# EAGLE design fp_binding_posts (EAGLE 9.3.1)
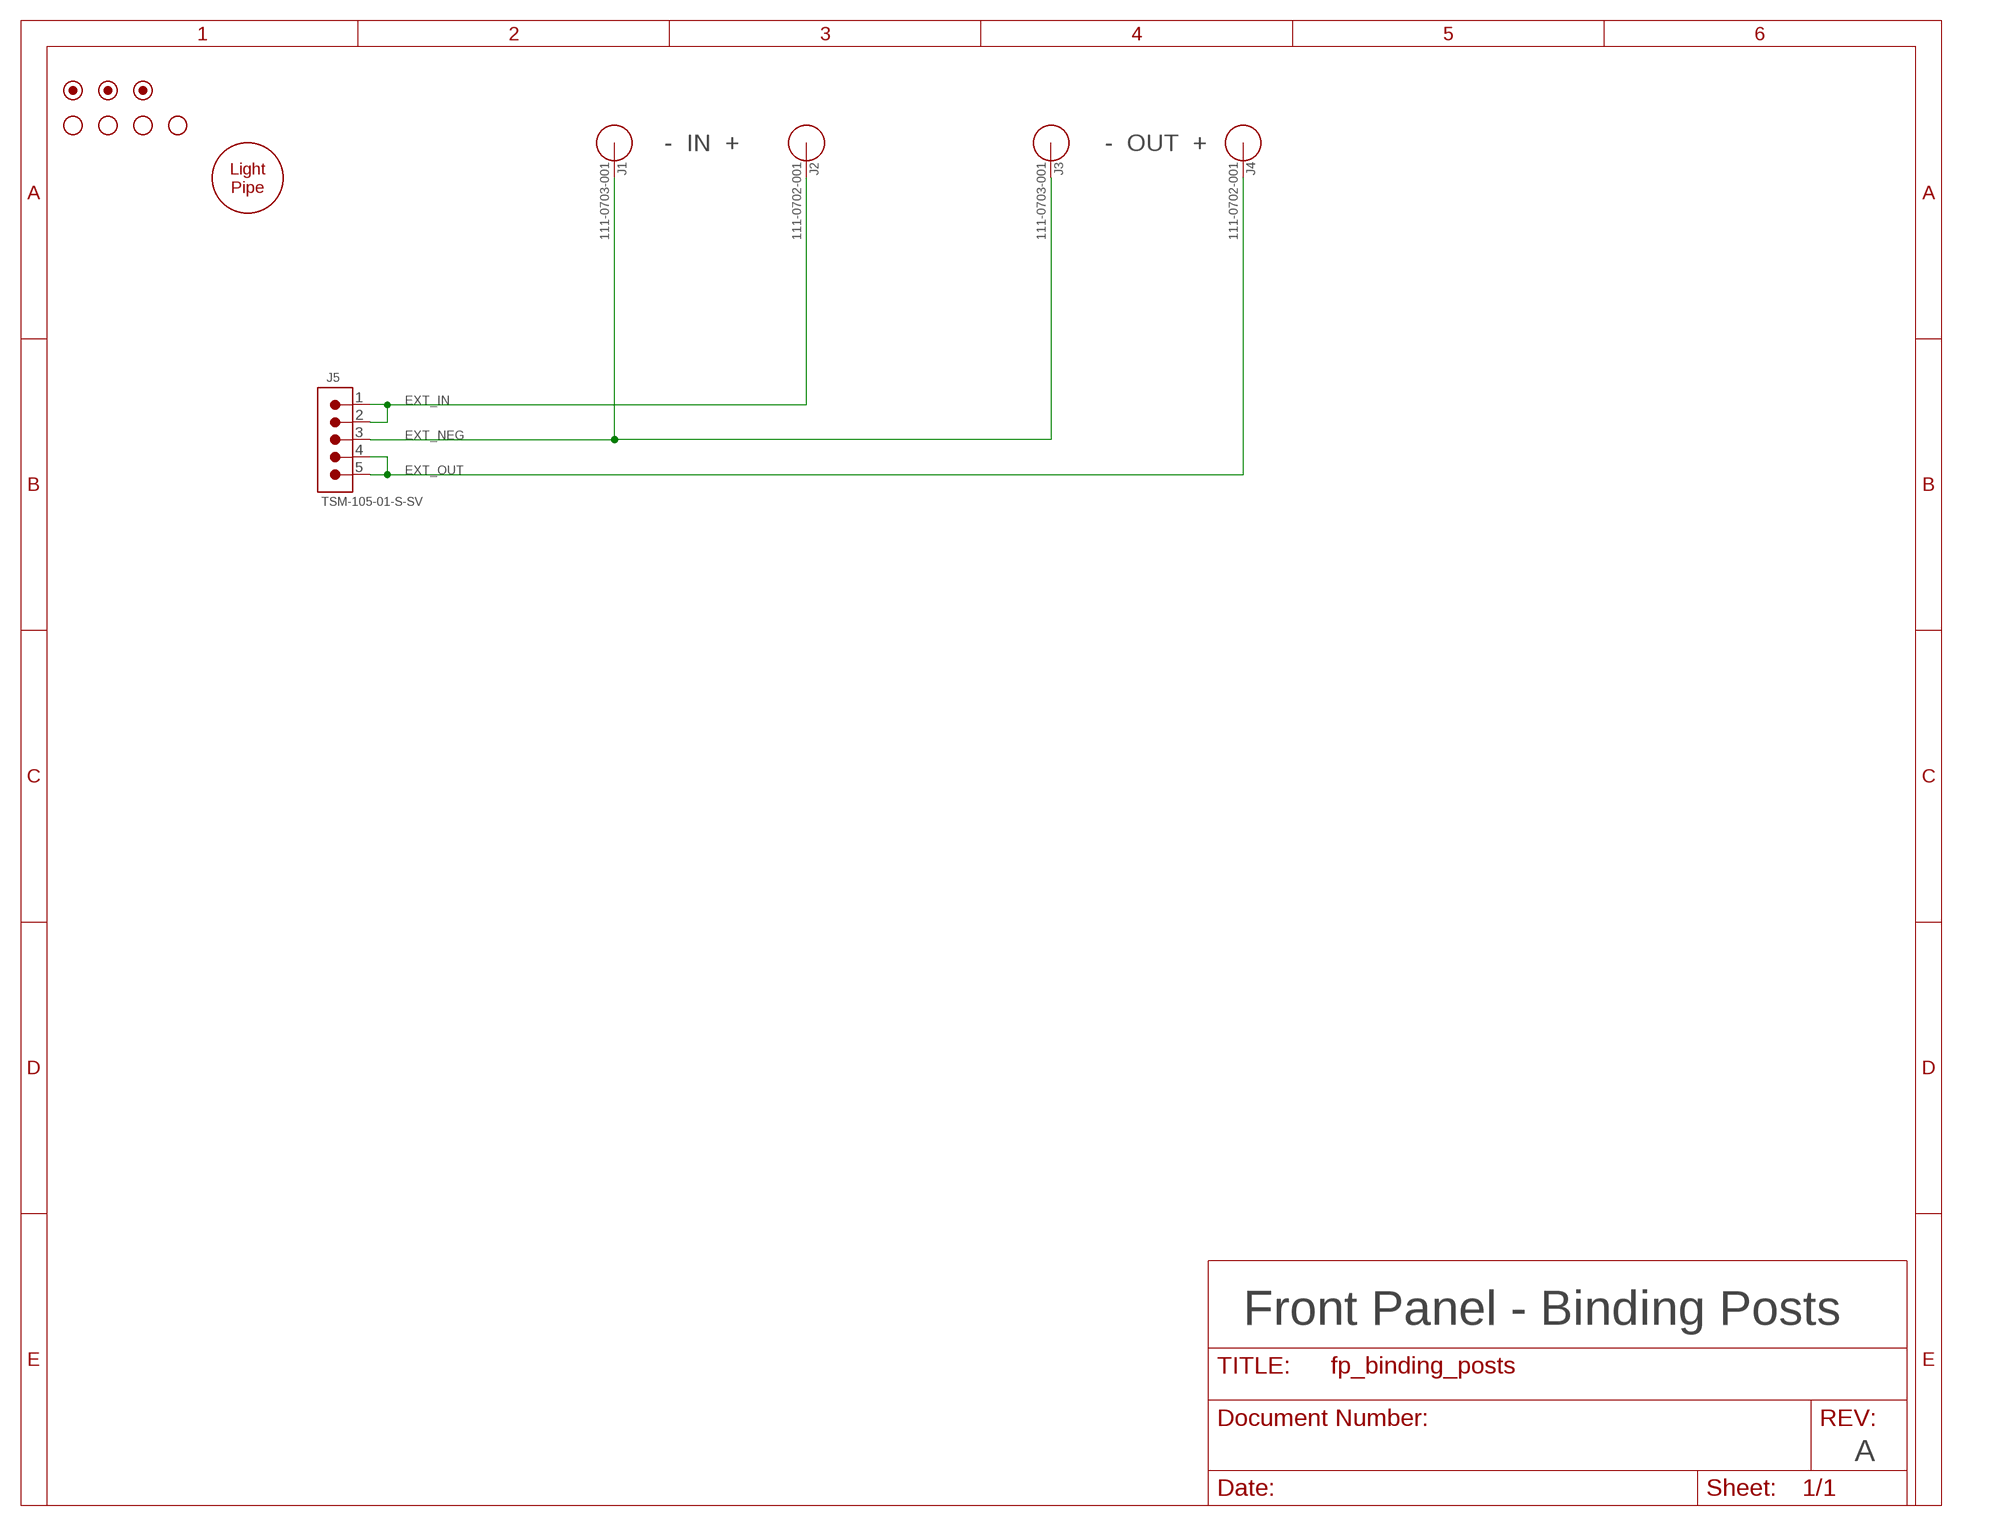
[diagram p0: schematic, sheet 1]

## Parts
FUD1  FIDUCIAL_1MM  [FIDUCIAL_1MM_2MM]
FUD2  FIDUCIAL_1MM  [FIDUCIAL_1MM_2MM]
FUD3  FIDUCIAL_1MM  [FIDUCIAL_1MM_2MM]
H1  51513020125F  LIGHT_PIPE_PANEL_3MM  [LP_3MM]
H2  HOLE_#6  [HOLE_3.5MM]
H3  HOLE_#6  [HOLE_3.5MM]
H4  HOLE_#6  [HOLE_3.5MM]
H5  HOLE_#6  [HOLE_3.5MM]
J1  111-0703-001  BINDING_POST_6  [BINDING_POST_6]
J2  111-0702-001  BINDING_POST_6  [BINDING_POST_6]
J3  111-0703-001  BINDING_POST_6  [BINDING_POST_6]
J4  111-0702-001  BINDING_POST_6  [BINDING_POST_6]
J5  TSM-105-01-S-SV  CONN_0.1_5X1_MS  [CONN_0.1_5X1_MS]

## Nets
EXT_IN: J2.1 J5.1 J5.2
EXT_NEG: J1.1 J3.1 J5.3
EXT_OUT: J4.1 J5.4 J5.5

## Notes on the sheet
- -  IN  + | -  OUT  +
- Front Panel - Binding Posts
- A

## Library data of the parts
FUD1-FUD3 = jetperch:FIDUCIAL; POPULATE: 0
H1 = jetperch:LIGHT_PIPE; MPN: 51513020125F; POPULATE: 1
H2-H5 = jetperch:HOLE
J1-J4 = jetperch:BINDING_POST; POPULATE: 1
J5 = jetperch:CONN_0.1_5X1; MPN: TSM-105-01-S-SV; POPULATE: 1

## Board
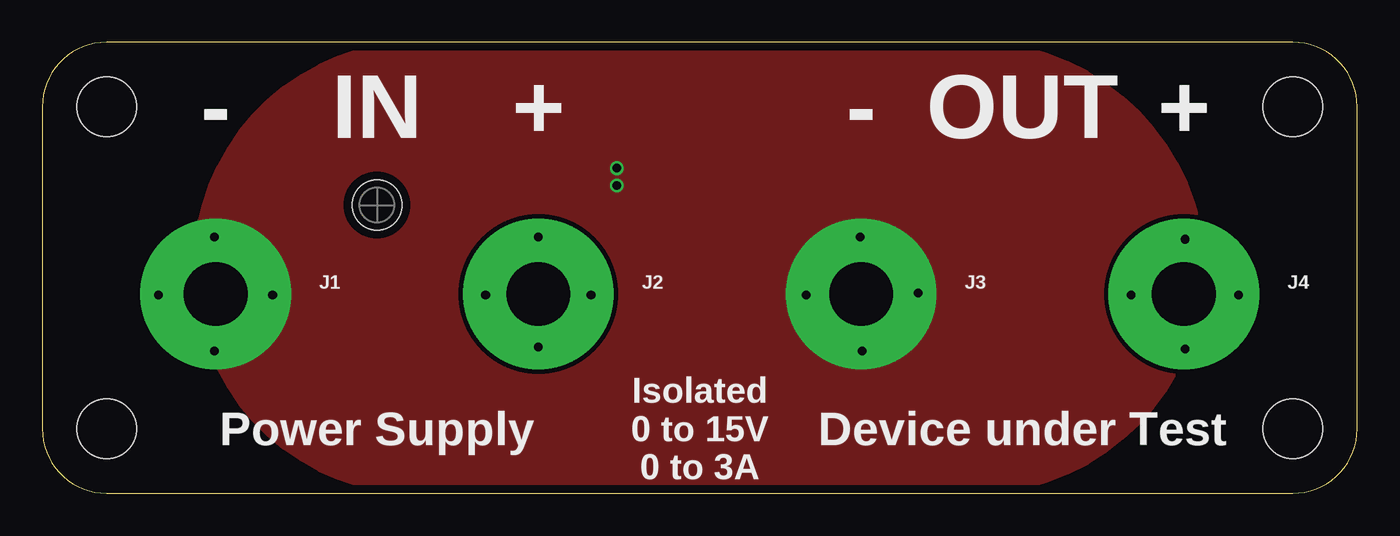
[diagram p1: board, top side]
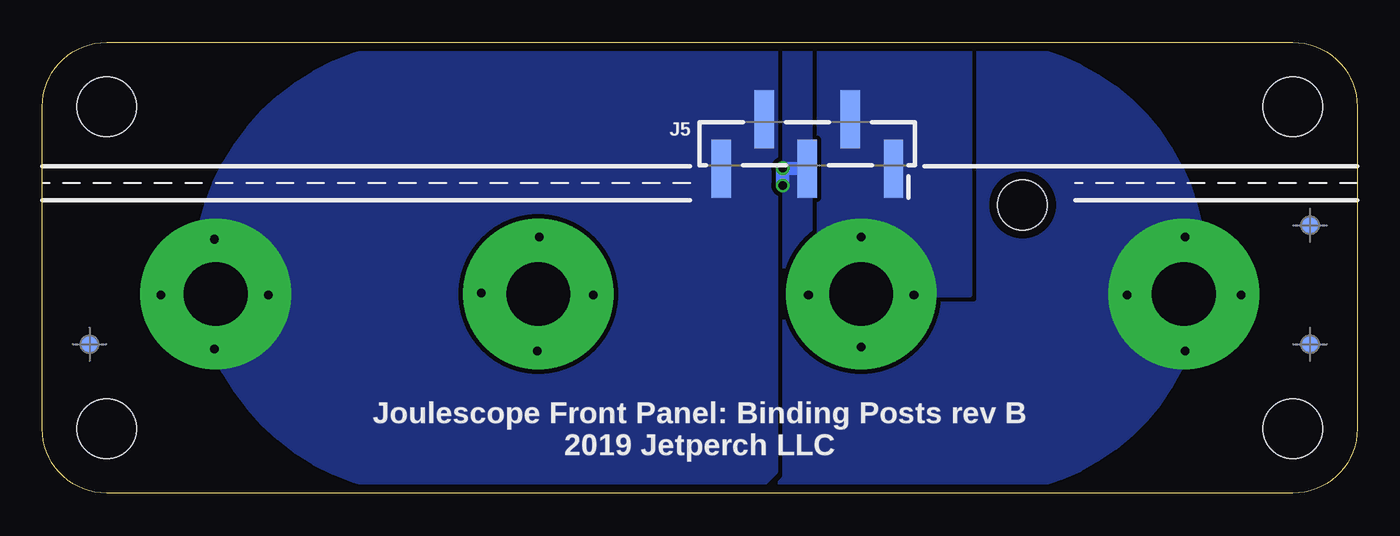
[diagram p2: board, bottom side, seen from below]

Size 77.6 x 26.6 mm. Coordinates in mm from the lower left corner, seen from the top.
Outline: 0,22.81 0,3.79 arc90 3.79,0 73.81,0 arc90 77.6,3.79 77.6,22.81 arc90 73.81,26.6 3.79,26.6 arc90 0,22.81
Copper layers (1*16): Top 0.035mm / dielectric 62mil / Bottom 0.035mm
Design rules "jetperch_2layer *": minimum track width 6mil, minimum drill 15mil, track to track 10mil, track to pad 10mil, pad to pad 10mil, via to via 10mil, smd to smd 0mil, copper to edge 20mil, drill to drill 15mil, minimum pad ring 6mil, minimum via ring 6mil, stop-mask expansion 2mil, vias tented up to drill 22mil, thermal gap 10mil
bKeepout: area 0,17.3 to 25.5,19.3; area 52.1,17.3 to 77.6,19.3; area 0,0 to 77.6,1.5; area 0,25.1 to 77.6,26.6; area 0,0 to 1.5,26.6; area 76.1,0 to 77.6,26.6

### Footprints (pad centres in the part's own frame; a part is rotated, then mirrored left to right if it is on the bottom)
FIDUCIAL_1MM_2MM = smd 1.016 x 1.016: P1 0,0
LP_3MM = hole 2.921: 0,0
HOLE_3.5MM = hole 3.5: 0,0
BINDING_POST_6 = drill 3.759 pad 8.89: 1 0,0
CONN_0.1_5X1_MS = smd 1.143 x 3.429: 1 -5.08,1.46; 2 -2.54,-1.46; 3 0,1.46; 4 2.54,-1.46; 5 5.08,1.46

### Placement (x,y rotation side)
FUD1  2.79,8.79 0 bottom
FUD2  74.81,8.79 0 bottom
FUD3  2.79,15.81 0 bottom
H1  19.75,17 0 top
H2  3.79,3.79 0 top
H3  3.79,22.81 0 top
H4  73.81,3.79 0 top
H5  73.81,22.81 0 top
J1  10.22,11.76 0 top
J2  29.27,11.76 0 top
J3  48.33,11.76 0 top
J4  67.38,11.76 0 top
J5  32.45,20.61 180 bottom

### Tracks (layer width: path | path; a pad name or v marks a point on that pad's centre or on a via)
EXT_IN  (via drill 0.51)
  Top 0.254: J2.1 32.31,11.76 v32.38,11.68 | J2.1 26.24,11.76 v26.16,11.68 | J2.1 v29.27,8.64 | J2.1 v29.27,15.11
  pour Bottom (isolate 0.254, no thermals): 31.75,26.54 22.86,26.54 22.86,11.68 31.75,11.68
EXT_NEG  (via drill 0.51)
  Top 0.254: J1.1 7.04,11.76 arc45 v6.86,11.68 | J1.1 10.22,14.96 arc45 v10.16,15.11 | J1.1 13.41,11.76 arc-45 v13.59,11.68 | J1.1 10.22,8.54 arc-45 v10.16,8.38 | J3.1 51.57,11.76 arc45 v51.69,11.81 | J3.1 arc-45 48.26,11.92 v48.26,15.11 | J3.1 45.27,11.76 arc45 v45.09,11.68 | J3.1 48.33,8.53 arc45 v48.39,8.38
  Bottom 0.76: v33.91,19.18 v33.91,18.16
  Bottom 0.762: v33.91,19.18 33.89,19.15 J5.3
  pour Top (no thermals): 22.3,26.6 54.3,26.6 arc-90 68.6,13.3 arc-90 54.3,0 22.3,0 arc-90 9,13.3 arc-90
  pour Bottom (rank 3, no thermals): 34.29,26.6 22.3,26.6 arc90 9,13.3 arc90 22.3,0 34.29,0
EXT_OUT  (via drill 0.51)
  Top 0.254: J4.1 70.54,11.76 v70.61,11.68 | J4.1 67.38,8.57 v67.44,8.51 | J4.1 67.38,14.92 v67.44,14.99 | J4.1 64.34,11.76 v64.26,11.68
  pour Bottom (isolate 0.254, no thermals): 34.29,26.6 54.17,26.6 arc-90 68.6,13.3 arc-90 54.17,0 35.56,0 34.29,1.27

### Text on the board
_tsilk: - | IN | + | - | OUT | + | Power Supply | Isolated / 0 to 15V / 0 to 3A | Device under Test
_bsilk: Joulescope Front Panel: Binding Posts rev B / 2019 Jetperch LLC
FabDoc1: All dimensions in millimeters